# EAGLE design watchplb_gps_v1_1 (EAGLE 6.5.0)
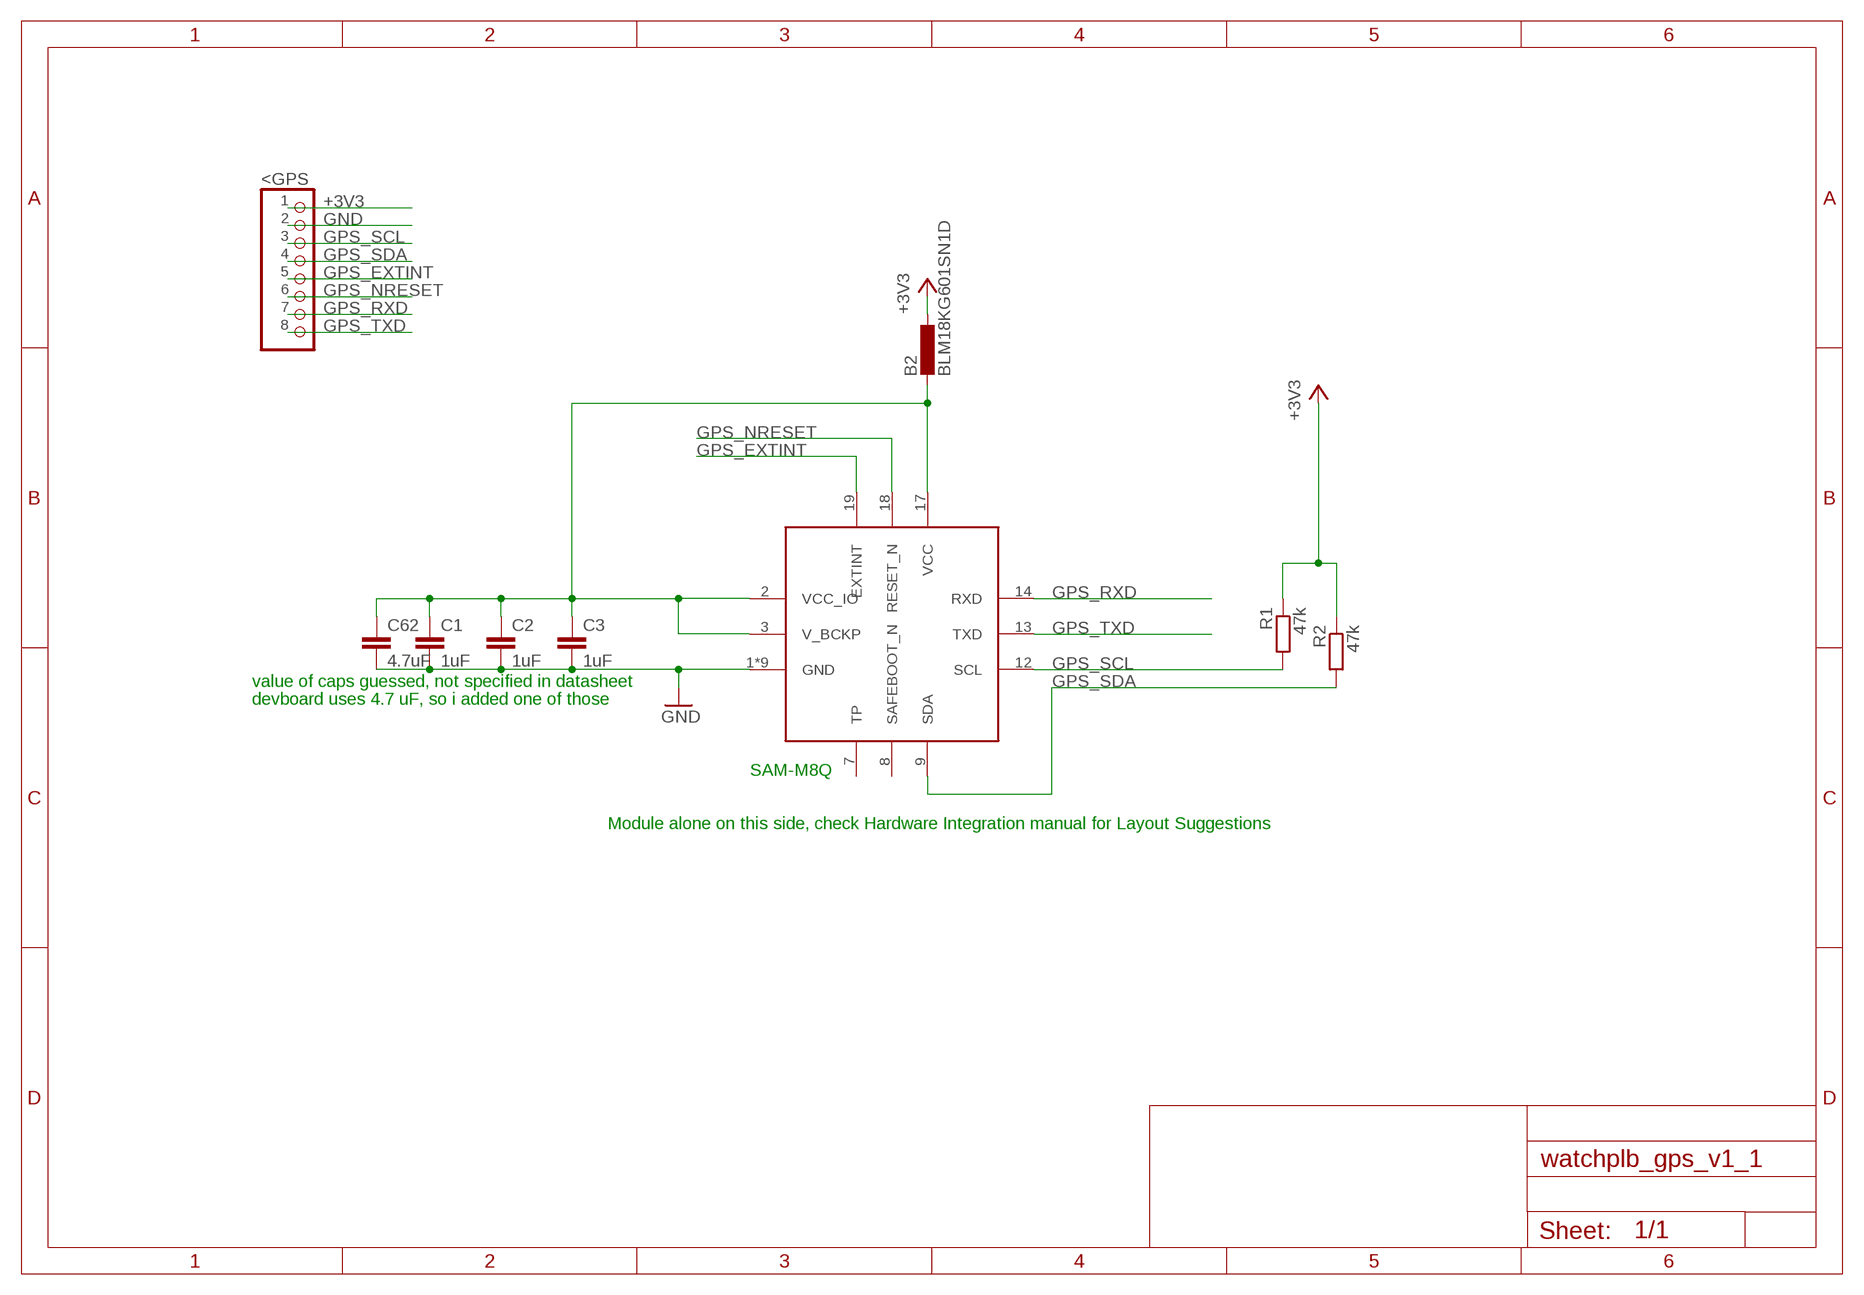
[diagram p0: schematic, sheet 1]

## Parts
<GPS  PINHD-1X8  [1X08]
B2  BLM18KG601SN1D  B-EU_B0603  [L0603]
C1  1uF  C-EUC0805  [C0805]
C2  1uF  C-EUC0805  [C0805]
C3  1uF  C-EUC0805  [C0805]
C62  4.7uF  C-EUC0805  [C0805]
IC1  SAM-M8Q  [SAM-M8Q]
R1  47k  R-EU_M0805  [M0805]
R2  47k  R-EU_M0805  [M0805]

## Nets
+3V3: <GPS.1 B2.1 R1.1 R2.1
GND: <GPS.2 C1.2 C2.2 C3.2 C62.2 IC1.1(GND) IC1.4(GND) IC1.5(GND) IC1.6(GND) IC1.10(GND) IC1.11(GND) IC1.15(GND) IC1.16(GND) IC1.20(GND)
GPS_EXTINT: <GPS.5 IC1.19(EXTINT)
GPS_NRESET: <GPS.6 IC1.18(RESET_N)
GPS_RXD: <GPS.7 IC1.14(RXD)
GPS_SCL: <GPS.3 IC1.12(SCL) R1.2
GPS_SDA: <GPS.4 IC1.9(SDA) R2.2
GPS_TXD: <GPS.8 IC1.13(TXD)
N$79: B2.2 C1.1 C2.1 C3.1 C62.1 IC1.2(VCC_IO) IC1.3(V_BCKP) IC1.17(VCC)
Unconnected: IC1.7(TP) IC1.8(SAFEBOOT_N)

## Notes on the sheet
- value of caps guessed, not specified in datasheet
- devboard uses 4.7 uF, so i added one of those
- SAM-M8Q
- Module alone on this side, check Hardware Integration manual for Layout Suggestions

## Library data of the parts
<GPS = pinhead:PINHD-1X8: PIN HEADER
B2 = PCB4_Demoboard:B-EU_: EMI Filter
C1-C3 C62 = resistor:C-EU: CAPACITOR, European symbol
IC1 = ubloxLib:SAM-M8Q: u-blox SAM GNSS antenna module
R1 R2 = resistor:R-EU_: RESISTOR, European symbol

## Board
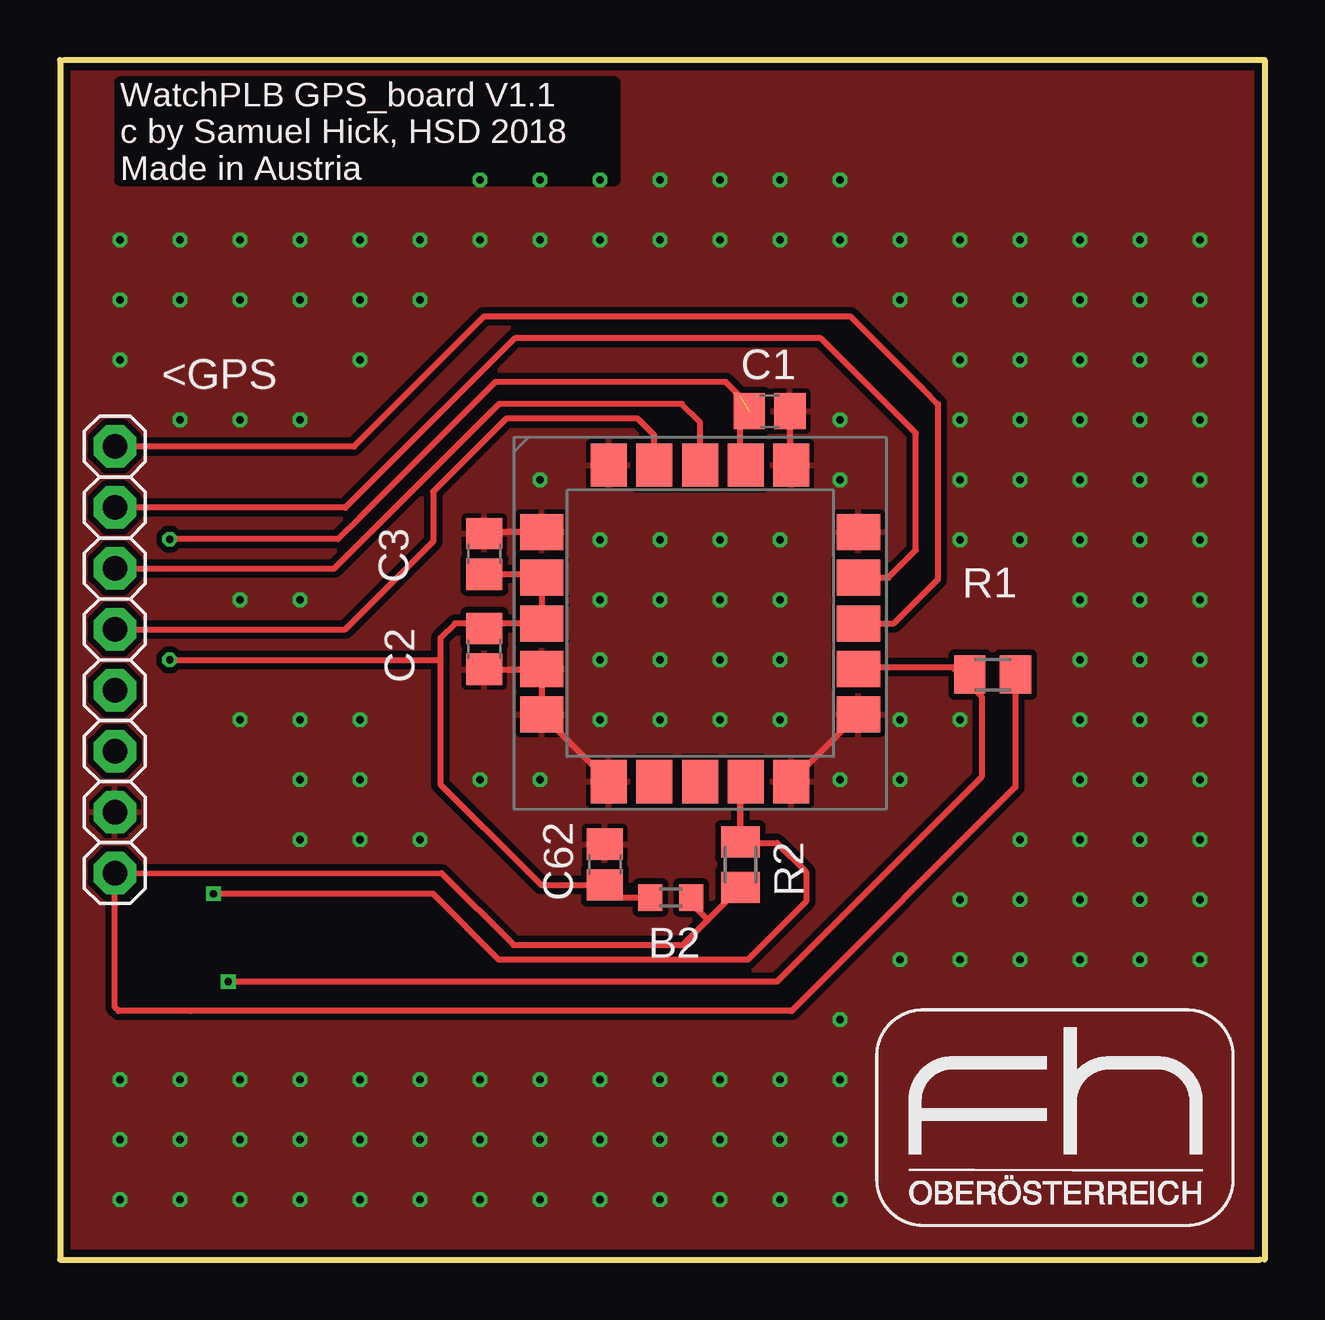
[diagram p1: board, top side]
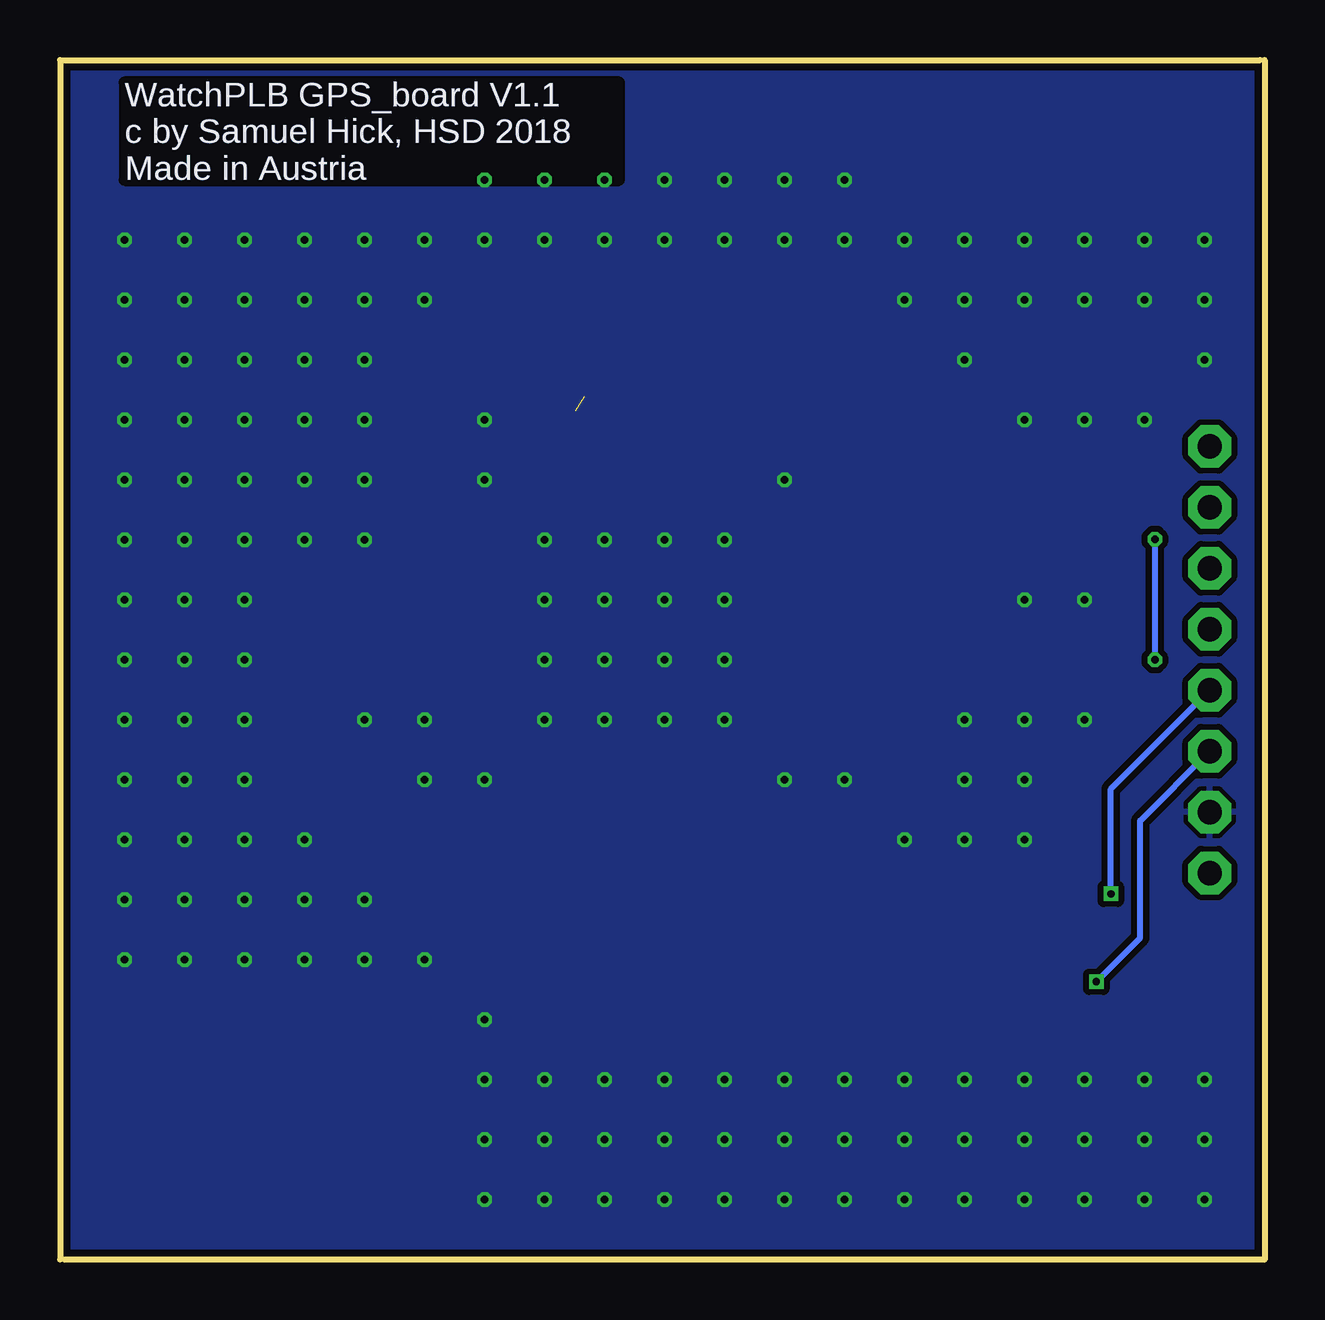
[diagram p2: board, bottom side, seen from below]

Size 50.19 x 50 mm. Coordinates in mm from the lower left corner, seen from the top.
Outline: 50.19,0 50.19,50 0.19,50
Outline: 0,50 0,0 50,0
Copper layers (1*16): Top 0.035mm / dielectric 1.5mm / Bottom 0.035mm
Design rules "PCB-POOL Standard": minimum track width 0.15mm, minimum drill 0.3mm, track to track 0.15mm, track to pad 0.15mm, pad to pad 0.15mm, via to via 0.15mm, smd to smd 0.15mm, copper to edge 0.3mm, drill to drill 0.2mm, minimum pad ring 0.2mm, minimum via ring 0.15mm, stop-mask expansion 0.075mm, vias tented up to drill 0mil, thermal gap 0.2mm

### Footprints (pad centres in the part's own frame; a part is rotated, then mirrored left to right if it is on the bottom)
1X08 = drill 1.016 pad 1.778 octagon: 1 -8.89,0; 2 -6.35,0; 3 -3.81,0; 4 -1.27,0; 5 1.27,0; 6 3.81,0; 7 6.35,0; 8 8.89,0
L0603 = smd 1 x 1.1: 1 -0.85,0; 2 0.85,0
C0805 = smd 1.3 x 1.5: 1 -0.85,0; 2 0.85,0
SAM-M8Q = smd 1.8 x 1.5: 1 -6.6,3.8; 2 -6.6,1.9; 3 -6.6,0; 4 -6.6,-1.9; 5 -6.6,-3.8; 11 6.6,-3.8; 12 6.6,-1.9; 13 6.6,0; 14 6.6,1.9; 15 6.6,3.8 | smd 1.5 x 1.8: 6 -3.8,-6.6; 7 -1.9,-6.6; 8 0,-6.6; 9 1.9,-6.6; 10 3.8,-6.6; 16 3.8,6.6; 17 1.9,6.6; 18 0,6.6; 19 -1.9,6.6; 20 -3.8,6.6
M0805 = smd 1.3 x 1.6: 1 -0.95,0; 2 0.95,0

### Placement (x,y rotation side)
<GPS  2.29,25 90 top
B2  25.45,15.09 180 top
C1  29.57,35.36 0 top
C2  17.68,25.45 270 top
C3  17.68,29.41 90 top
C62  22.71,16.46 90 top
IC1  26.67,26.52 0 top
R1  38.86,24.38 180 top
R2  28.35,16.46 90 top
U$1  [FH_LOGO_050]  33.79,1.21 0 top

### Tracks (layer width: path | path; a pad name or v marks a point on that pad's centre or on a via)
+3V3
  Top 0.254: 26.99,14.15 25.94,13.11 18.9,13.11 15.9,16.1 <GPS.1 2.29,10.52 2.44,10.36 5.49,10.36 30.48,10.36 39.81,19.7 R1.1 | 26.99,14.15 R2.1 | B2.1 26.15,15 26.67,14.48 26.99,14.15
GND  (via drill 0.3)
  Top 0.254: C2.2 19.9,24.6 IC1.4 IC1.5 IC1.6 | IC1.10 IC1.11 | IC1.1 17.58,30.32 C3.2 | C1.2 30.42,33.17 IC1.16
  other vias: 5,5 2.5,5 2.5,2.5 5,2.5 2.5,7.5 5,7.5 7.5,7.5 7.5,5 7.5,2.5 10,2.5 10,5 10,7.5 12.5,7.5 12.5,5 12.5,2.5 27.5,5 25,5 25,2.5 27.5,2.5 25,7.5 27.5,7.5 30,7.5 30,5 30,2.5 32.5,2.5 32.5,5 32.5,7.5 32.5,10 35,12.5 37.5,12.5 40,12.5 42.5,12.5 45,12.5 47.5,12.5 40,15 37.5,15 15,5 15,2.5 15,7.5 17.5,7.5 17.5,5 17.5,2.5 20,2.5 20,5 20,7.5 22.5,7.5 22.5,5 22.5,2.5 42.5,15 42.5,17.5 42.5,20 45,20 45,17.5 45,15 47.5,15 47.5,17.5 47.5,20 40,17.5 42.5,25 42.5,22.5 45,22.5 45,25 47.5,25 47.5,22.5 42.5,27.5 42.5,30 42.5,32.5 45,32.5 45,30 45,27.5 47.5,27.5 47.5,30 47.5,32.5 40,30 37.5,30 37.5,32.5 40,32.5 40,35 37.5,35 37.5,37.5 40,37.5 42.5,37.5 42.5,35 45,35 45,37.5 47.5,37.5 47.5,35 42.5,42.5 42.5,40 45,40 45,42.5 47.5,42.5 47.5,40 40,40 37.5,40 37.5,42.5 40,42.5 35,42.5 35,40 32.5,42.5 32.5,45 30,45 30,42.5 27.5,42.5 27.5,45 25,45 25,42.5 22.5,42.5 22.5,45 20,45 20,42.5 17.5,42.5 17.5,45 15,42.5 15,40 12.5,40 12.5,37.5 10,35 7.5,35 5,35 2.5,37.5 5,40 2.5,40 2.5,42.5 5,42.5 7.5,42.5 10,42.5 12.5,42.5 10,40 7.5,40 7.5,22.5 10,22.5 12.5,22.5 12.5,20 12.5,17.5 10,17.5 10,20 15,17.5 17.5,20 20,20 32.5,20 35,20 35,22.5 37.5,22.5 32.5,32.5 32.5,35 30,30 27.5,30 25,30 22.5,30 22.5,27.5 25,27.5 27.5,27.5 30,27.5 30,25 27.5,25 25,25 22.5,25 22.5,22.5 25,22.5 27.5,22.5 30,22.5 20,32.5 7.5,27.5 10,27.5
  pour Top (isolate 0.254): 0,50 0,0 50,0 50,50
  pour Bottom (isolate 0.254): 0,50 0,0 50,0 50,50
GPS_EXTINT
  Top 0.254: IC1.19 24.77,34.36 24.08,35.05 18.59,35.05 15.54,32 15.54,29.92 11.89,26.26 <GPS.5
GPS_NRESET
  Top 0.254: IC1.18 26.67,34.9 25.91,35.66 18.29,35.66 14.63,32 11.44,28.81 <GPS.6
GPS_RXD
  Top 0.254: IC1.14 34.51,28.42 35.66,29.57 35.66,34.44 31.7,38.41 18.95,38.41 11.89,31.34 <GPS.7
GPS_SCL  (via drill 0.3)
  Top 0.254: IC1.12 33.16,24.57 33.28,24.69 37.19,24.69 37.64,24.23 | 37.64,24.23 38.41,23.47 38.41,20.12 29.87,11.58 17.07,11.58 v7.01,11.58 | R1.2 37.76,24.23 37.64,24.23
  Bottom 0.254: v7.01,11.58 5.18,13.41 5.18,18.29 <GPS.3
GPS_SDA  (via drill 0.3)
  Top 0.254: R2.2 28.35,19.85 | 28.35,19.85 IC1.9 | 28.35,19.85 28.35,17.37 29.87,17.37 31.09,16.15 31.09,14.94 28.65,12.5 24.69,12.5 18.29,12.5 15.54,15.24 v6.4,15.24
  Bottom 0.254: v6.4,15.24 6.4,19.61 <GPS.4
GPS_TXD
  Top 0.254: IC1.13 34.75,26.52 36.58,28.35 36.58,35.66 35.97,36.27 32.92,39.32 17.68,39.32 12.24,33.88 <GPS.8
N$79  (via drill 0.3)  (1 unrouted)
  Top 0.254: IC1.3 17.74,26.52 C2.1 | C3.1 19.77,28.56 IC1.2 IC1.3 | IC1.3 16.46,26.52 15.85,25.91 15.85,24.99 | 15.85,24.99 15.85,19.81 19.51,16.15 20.05,15.61 C62.1 23.08,15.09 B2.2 | IC1.17 28.35,33.05 28.35,35.97 27.74,36.58 18.14,36.58 12.5,30.94 11.58,30.02 v4.57,30.02 | v4.57,24.99 15.85,24.99
  Bottom 0.254: v4.57,30.02 v4.57,24.99

### Text on the board
Top: WatchPLB GPS_board V1.1 / c by Samuel Hick, HSD 2018 / Made in Austria
Bottom: WatchPLB GPS_board V1.1 / c by Samuel Hick, HSD 2018 / Made in Austria
tPlace: WatchPLB GPS_board V1.1 / c by Samuel Hick, HSD 2018 / Made in Austria
bPlace: WatchPLB GPS_board V1.1 / c by Samuel Hick, HSD 2018 / Made in Austria